# Altium schematic sheet custom_line_V1_comp.SchDoc
size 209 x 297 mm
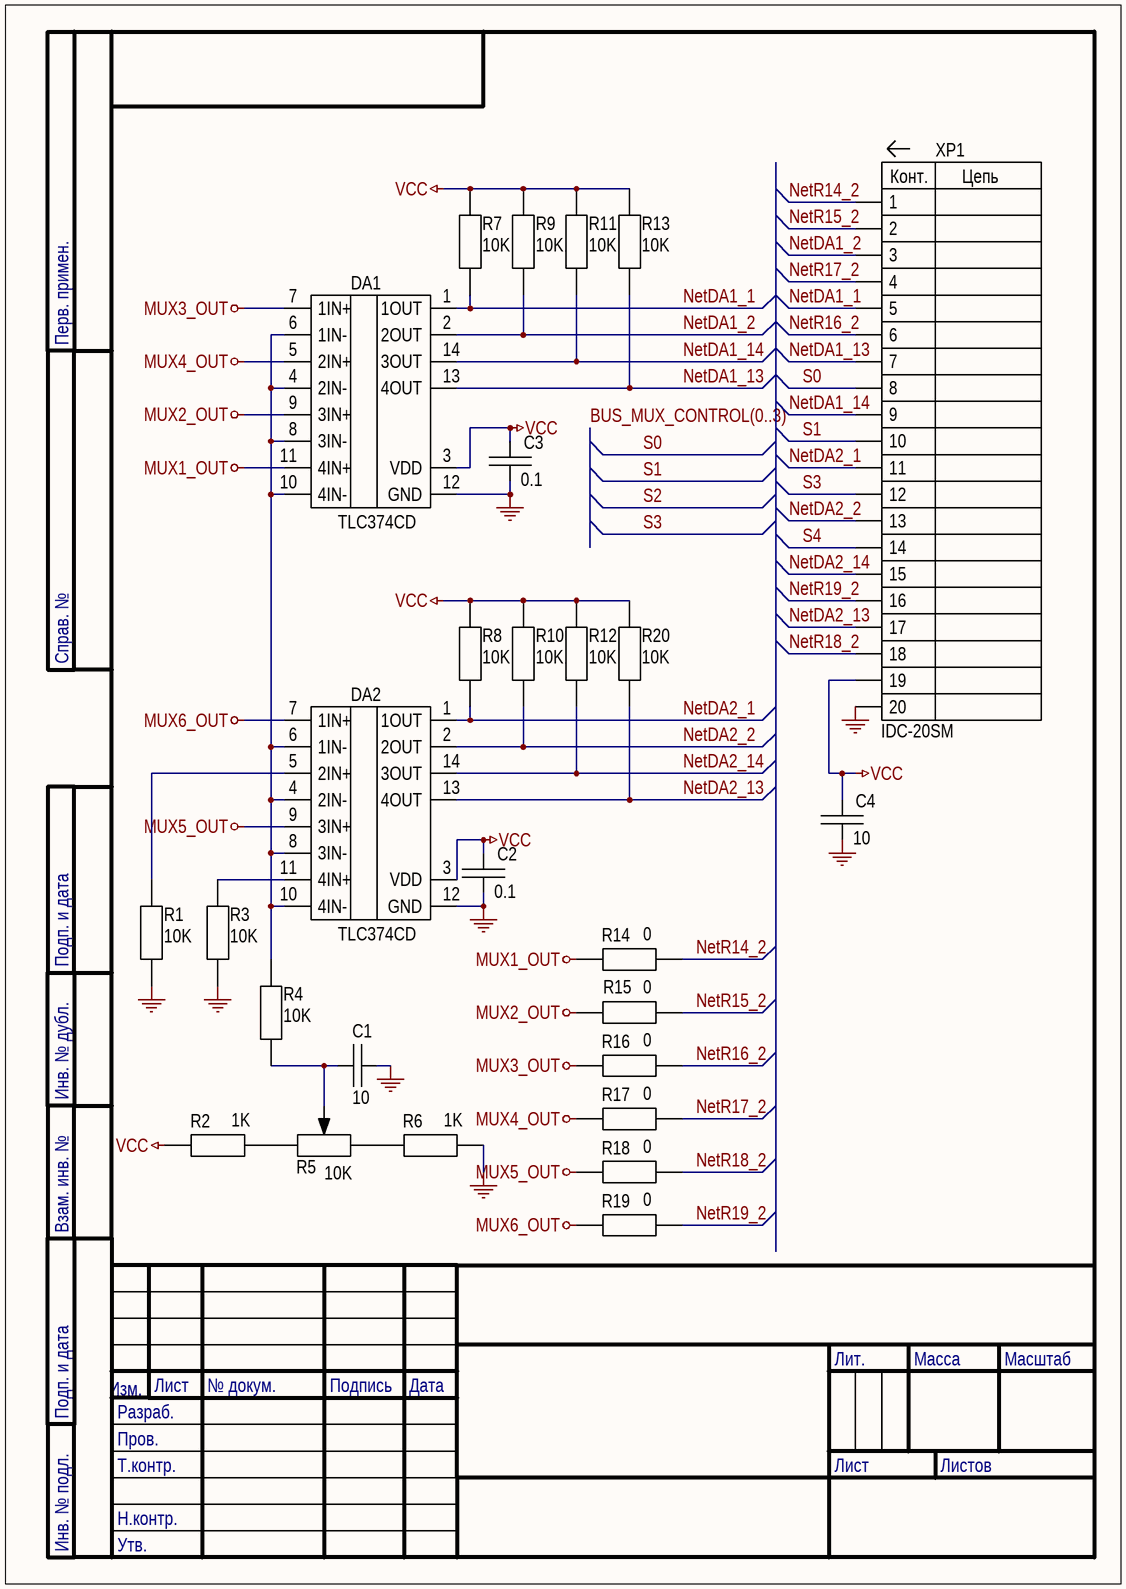
[diagram p0: custom_line_V1_comp.SchDoc]

## Parts
C1  10  [CC_0805]
C2  0.1  [CC_0603]
C3  0.1  [CC_0603]
C4  10  [CC_0805]
DA1  type: TLC374CD  [SOIC-14]  (hidden comment: TLC374)
DA2  type: TLC374CD  [SOIC-14]  (hidden comment: TLC374)
R1  10K  [RC_0603_SMALL]
R2  1K  [RC_0603_SMALL]
R3  10K  [RC_0603_SMALL]
R4  10K  [RC_0603_SMALL]
R5  10K  [Res_3266W]
R6  1K  [RC_0603_SMALL]
R7  10K  [RC_0603_SMALL]
R8  10K  [RC_0603_SMALL]
R9  10K  [RC_0603_SMALL]
R10  10K  [RC_0603_SMALL]
R11  10K  [RC_0603_SMALL]
R12  10K  [RC_0603_SMALL]
R13  10K  [RC_0603_SMALL]
R14  0  [RC_0603_SMALL]
R15  0  [RC_0603_SMALL]
R16  0  [RC_0603_SMALL]
R17  0  [RC_0603_SMALL]
R18  0  [RC_0603_SMALL]
R19  0  [RC_0603_SMALL]
R20  10K  [RC_0603_SMALL]
XP1  IDC-20SM  [IDC-20SM]

## Nets
GND: C1.1 C2.1 C3.1 C4.1 DA1.12(GND) DA2.12(GND) R1.2 R3.2 R6.2 XP1.20
MUX1_OUT: DA1.11(4IN+) R14.1
MUX2_OUT: DA1.9(3IN+) R15.1
MUX3_OUT: DA1.7(1IN+) R16.1
MUX4_OUT: DA1.5(2IN+) R17.1
MUX5_OUT: DA2.9(3IN+) R18.1
MUX6_OUT: DA2.7(1IN+) R19.1
VCC: C2.2 C3.2 C4.2 DA1.3(VDD) DA2.3(VDD) R2.1 R7.1 R8.1 R9.1 R10.1 R11.1 R12.1 R13.1 R20.1 XP1.19
NetDA1_1: DA1.1(1OUT) R7.2 XP1.5
NetDA1_2: DA1.2(2OUT) R9.2 XP1.3
NetDA1_13: DA1.13(4OUT) R13.2 XP1.7
NetDA1_14: DA1.14(3OUT) R11.2 XP1.9
NetDA2_1: DA2.1(1OUT) R8.2 XP1.11
NetDA2_2: DA2.2(2OUT) R10.2 XP1.13
NetDA2_13: DA2.13(4OUT) R20.2 XP1.17
NetDA2_14: DA2.14(3OUT) R12.2 XP1.15
NetR14_2: R14.2 XP1.1
NetR15_2: R15.2 XP1.2
NetR16_2: R16.2 XP1.6
NetR17_2: R17.2 XP1.4
NetR18_2: R18.2 XP1.18
NetR19_2: R19.2 XP1.16
S0: XP1.8
S1: XP1.10
S3: XP1.12
S4: XP1.14
NetC1_2: C1.2 R4.2 R5.2
NetDA1_4: DA1.4(2IN-) DA1.6(1IN-) DA1.8(3IN-) DA1.10(4IN-) DA2.4(2IN-) DA2.6(1IN-) DA2.8(3IN-) DA2.10(4IN-) R4.1
NetDA2_5: DA2.5(2IN+) R1.1
NetDA2_11: DA2.11(4IN+) R3.1
NetR2_2: R2.2 R5.1
NetR5_3: R5.3 R6.1

## Buses and harness runs
bus BUS_MUX_CONTROL(0..3)

## Notes on the sheet
- Перв. примен.
- Справ. №
- Подп. и дата
- Инв. № дубл.
- Взам. инв. №
- Изм.
- Лист
- № докум.
- Подпись
- Дата
- Лит.
- Масса
- Масштаб
- Разраб.
- Пров.
- Т.контр.
- Листов
- Н.контр.
- Инв. № подл.
- Утв.
- (in symbol XT_IDC-20SM) Конт.; Цепь

## Library data of the parts
C1 C4 = C: SMD Cap 0805,106, 16V, X5R, 10% (YAGEO); type: CC0805KKX7R7BB106; value: 10uF
C2 C3 = C: SMD Cap 0603, 104, 16V, X7R, 10% (YAGEO); type: CC0603KRX7R7BB104; value: 0.1uF
DA1 DA2 = TLC374: Four Comparators (Texas Instruments)
R1 R3 R4 R7-R13 R20 = R: SMD Res 0603, 10 kOh, 1% (YAGEO); power: 0.125W; type: AC0603FR-0710KL; value: 10K
R2 R6 = R: SMD Res 0603, 1 kOh, 1% (YAGEO); power: 0.125W; type: AC0603FR-071KL; value: 1K
R5 = R_potentiometer: Trimming Potentiometer 3266W (Bourns); Tupe: 3266W-1-103LF; power: 0.25W; value: 10K
R14-R19 = R: power: 0.125W; type: RC-0603-000-5%; value: 0
XP1 = XT_IDC-20SM: Connector IDC-20SM (Connfly); type: DS1013-20SSIB1-B-0